# Altium schematic sheet Pulser.SchDoc: Pulser Laser Board
size A4; Date: 04.08.2023; DocumentNumber: 2; SheetNumber: 2; SheetTotal: 2; FileInfo: Pulser.SchDoc
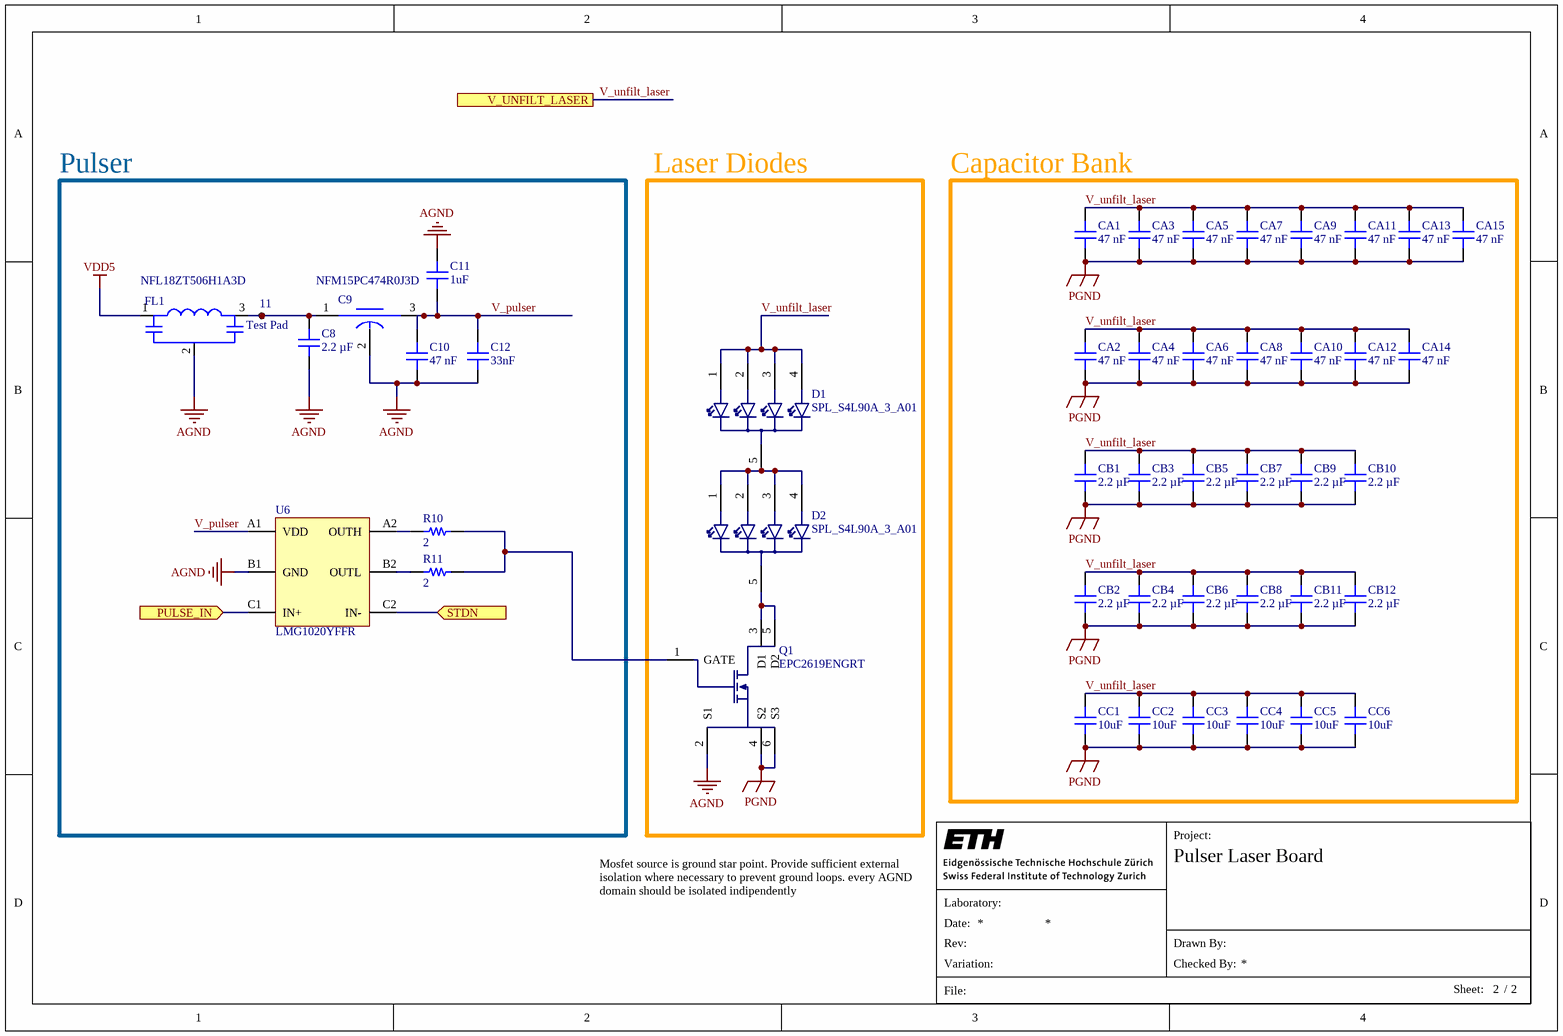
[diagram p0: Pulser.SchDoc]

## Parts
11  Test Pad  [Pad-0.6mm]  (no BOM)
C8  2.2 µF  [CAP 0603_1608]
C9  NFM15PC474R0J3D  [FP-NFM15-0_05-MFG]
C10  47 nF  [CAPC0510X35N]
C11  1uF  [FP-LLL152-0_2-MFG]
C12  33nF  [FP-LLL03T-0_03-IPC_C]
CA1  47 nF  [CAPC0510X35N]
CA2  47 nF  [CAPC0510X35N]
CA3  47 nF  [CAPC0510X35N]
CA4  47 nF  [CAPC0510X35N]
CA5  47 nF  [CAPC0510X35N]
CA6  47 nF  [CAPC0510X35N]
CA7  47 nF  [CAPC0510X35N]
CA8  47 nF  [CAPC0510X35N]
CA9  47 nF  [CAPC0510X35N]
CA10  47 nF  [CAPC0510X35N]
CA11  47 nF  [CAPC0510X35N]
CA12  47 nF  [CAPC0510X35N]
CA13  47 nF  [CAPC0510X35N]
CA14  47 nF  [CAPC0510X35N]
CA15  47 nF  [CAPC0510X35N]
CB1  2.2 µF  [CAP 0603_1608]
CB2  2.2 µF  [CAP 0603_1608]
CB3  2.2 µF  [CAP 0603_1608]
CB4  2.2 µF  [CAP 0603_1608]
CB5  2.2 µF  [CAP 0603_1608]
CB6  2.2 µF  [CAP 0603_1608]
CB7  2.2 µF  [CAP 0603_1608]
CB8  2.2 µF  [CAP 0603_1608]
CB9  2.2 µF  [CAP 0603_1608]
CB10  2.2 µF  [CAP 0603_1608]
CB11  2.2 µF  [CAP 0603_1608]
CB12  2.2 µF  [CAP 0603_1608]
CC1  10uF  [CAP 0603_1608]
CC2  10uF  [CAP 0603_1608]
CC3  10uF  [CAP 0603_1608]
CC4  10uF  [CAP 0603_1608]
CC5  10uF  [CAP 0603_1608]
CC6  10uF  [CAP 0603_1608]
D1  SPL_S4L90A_3_A01  [SPLS4L90A_3A01]
D2  SPL_S4L90A_3_A01  [SPLS4L90A_3A01]
FL1  NFL18ZT506H1A3D  [NFL18ST107H1A3D]
Q1  EPC2619ENGRT  [EPC2619ENGRT]
R10  2  [RES 0201_0603]
R11  2  [RES 0201_0603]
U6  LMG1020YFFR  [BGA6C40P2X3_86X126X62]

## Blocks framed on the sheet
Pulser: 11 C8-C12 FL1 R10 R11 U6
Laser Diodes: D1 D2 Q1
Capacitor Bank: CA1-CA15 CB1-CB12 CC1-CC6

## Ports
PULSE_IN (in), STDN (in), V_UNFILT_LASER

## Nets
AGND: C8.1 C9.2(GND) C10.1 C11.2 C12.1 FL1.2 Q1.2(S1) U6.B1(GND)
PGND: CA1.1 CA2.1 CA3.1 CA4.1 CA5.1 CA6.2 CA7.1 CA8.1 CA9.1 CA10.1 CA11.1 CA12.2 CA13.2 CA14.1 CA15.1 CB1.1 CB2.1 CB3.1 CB4.1 CB5.1 CB6.1 CB7.1 CB8.1 CB9.1 CB10.1 CB11.1 CB12.1 CC1.1 CC2.1 CC3.1 CC4.1 CC5.1 CC6.1 Q1.4(S2) Q1.6(S3)
VDD5: FL1.1
PULSE_IN: U6.C1(IN+) ; port PULSE_IN
STDN: U6.C2(IN-) ; port STDN
V_pulser: C9.3(Output) C10.2 C11.1 C12.2 U6.A1(VDD)
V_unfilt_laser: CA1.2 CA2.2 CA3.2 CA4.2 CA5.2 CA6.1 CA7.2 CA8.2 CA9.2 CA10.2 CA11.2 CA12.1 CA13.1 CA14.2 CA15.2 CB1.2 CB2.2 CB3.2 CB4.2 CB5.2 CB6.2 CB7.2 CB8.2 CB9.2 CB10.2 CB11.2 CB12.2 CC1.2 CC2.2 CC3.2 CC4.2 CC5.2 CC6.2 D1.1(ANODE_CH1) D1.2(ANODE_CH2) D1.3(ANODE_CH3) D1.4(ANODE_CH4) ; port V_UNFILT_LASER
Net11_1: 11.1 C8.2 C9.1(Input) FL1.3
NetD1_5: D1.5(COM_CATHODE) D2.1(ANODE_CH1) D2.2(ANODE_CH2) D2.3(ANODE_CH3) D2.4(ANODE_CH4)
NetD2_5: D2.5(COM_CATHODE) Q1.3(D1) Q1.5(D2)
NetQ1_1: Q1.1(GATE) R10.2 R11.2
NetR10_1: R10.1 U6.A2(OUTH)
NetR11_1: R11.1 U6.B2(OUTL)

## Notes on the sheet
- Mosfet source is ground star point. Provide sufficient external isolation where necessary to prevent ground loops. every AGND domain should be isolated indipendently
- Project:
- Laboratory:
- Date:
- File:
- Rev:
- Variation:
- Drawn By:
- Checked By:
- Sheet:
- /

## Library data of the parts
11 = Test Pad: 0.6mm SMT Test Pad; Mounting Technology: SMT
C8 CB1-CB12 = GRM188R61H225KE11D: CAP CER 2.2UF 50V X5R 0603; manufacturer: Murata Electronics; Tolerance: ±10%; Part Number: GRM188R61H225KE11D; Applications: General Purpose; Capacitance: 2.2 µF; componentlink1description: Datasheet; componentlink1url: https://search.murata.co.jp/Ceramy/image/img/A01X/G101/ENG/GRM188R61H225KE11-01.pdf; componentlink2description: DigiKey Link; componentlink2url: https://www.digikey.com/en/products/detail/murata-electronics/GRM188R61H225KE11D/4905363; Device Package: 0603 (1608 Metric); lastupdated: 15/07/2023 19:07:37; Lifecycle Status: Active; Minimum Order: 1; Mounting Type: Surface Mount, MLCC; Operating Temperature: -55°C ~ 85°C; Package / Case: 0603 (1608 Metric); packaging: TapeAndReel; partid: 39151; Part Status: Active; price: 0.04; series: GRM; Size / Dimension: 0.063" L x 0.031" W (1.60mm x 0.80mm); Supplier 1: DigiKey; Supplier Part Number 1: 490-10733-1-ND; Temperature Coefficient: X5R; Thickness (Max): 0.039" (1.00mm); Voltage - Rated: 50V; Value: 2.2 µF; Supplier 2: Mouser; Supplier Part Number 2: 81-GRM188R61H225KE1D
C9 = NFM15PC474R0J3D: CAP Feed Through, 470 nF, 6.3V, 2A, 3 Pin(s); Manufacturer: Murata; Tolerance: 20%; DC Resistance (DCR): 30mR; Capacitance: 470nF; Voltage Rating: 4V; Channels: 1; Filter Type: FEED THROUGH CAPACITOR; Value: 470mF; Length: 0.039inch; Max Operating Temperature: 105°C; Case/Package: 0402; Width: 0.02inch; Packaging: Tape and Reel; Current: 2A; Mount: Surface Mount; Height: 0.02inch; Min Operating Temperature: -55°C; Package Quantity: 10000; Manufacturer Part Number: NFM15PC474R0J3D; Category: Ceramic Capacitors; ComponentLink1Description: https://datasheet.ciiva.com:443/pdfs/VipMasterIC/IC/MURE/MURE-S-A0002978318/MURE-S-A0002990019-1.pdf?src-supplier=IHS+Markit; ComponentLink1URL: https://datasheet.ciiva.com:443/pdfs/VipMasterIC/IC/MURE/MURE-S-A0002978318/MURE-S-A0002990019-1.pdf?src-supplier=IHS+Markit; ComponentLink2Description: http://www.mouser.com/ds/2/281/c31e-794748.pdf?src-supplier=Mouser; ComponentLink2URL: http://www.mouser.com/ds/2/281/c31e-794748.pdf?src-supplier=Mouser; ComponentLink3Description: https://search.murata.co.jp/Ceramy/image/img/A01X/G101/ENG/NFM15PC474R0J3-01.pdf?src-supplier=Digi-Key; ComponentLink3URL: https://search.murata.co.jp/Ceramy/image/img/A01X/G101/ENG/NFM15PC474R0J3-01.pdf?src-supplier=Digi-Key; ComponentLink4Description: http://search.murata.co.jp/Ceramy/image/img/A01X/G101/ENG/NFM15PC474R0J3-01.pdf?src-supplier=Digi-Key; ComponentLink4URL: http://search.murata.co.jp/Ceramy/image/img/A01X/G101/ENG/NFM15PC474R0J3-01.pdf?src-supplier=Digi-Key; ComponentLink5Description: http://search.murata.co.jp/Ceramy/image/img/w_hinm/S0109E.pdf?src-supplier=Digi-Key; ComponentLink5URL: http://search.murata.co.jp/Ceramy/image/img/w_hinm/S0109E.pdf?src-supplier=Digi-Key; ComponentLink6Description: https://datasheet.octopart.com/NFM15PC474R0J3D-Murata-datasheet-82526264.pdf?src-supplier=Future+Electronics; ComponentLink6URL: https://datasheet.octopart.com/NFM15PC474R0J3D-Murata-datasheet-82526264.pdf?src-supplier=Future+Electronics; Current Rating: 2A; DC Resistance-Max: 30mR; Mounting Technology: Surface Mount; Pricing: 1=0.1, 10=0.048, 50=0.048, 100=0.043, 1000=0.027, 10000=0.024 (USD); Reach SVHC Compliant: Yes; RoHS: Yes; RoHS Compliant: Yes; Stock: 109781; Supplier 1: Mouser; Supplier: Mouser; Supplier Part Number 1: 81-NFM15PC474R0J3D; Supplier Part Number: 81-NFM15PC474R0J3D
C10 CA1-CA15 = CGAEA1X7R1H473M030BC: CAP CER 47 nF, 50V, 20%  X7R  0204; Manufacturer_Name: TDK; Datasheet Link: https://product.tdk.com/system/files/dam/doc/product/capacitor/ceramic/mlcc/catalog/mlcc_automotive_lwreverse_cga_en.pdf; Height: 0.35mm; Manufacturer_Part_Number: CGAEA1X7R1H473M030BC; Mouser Part Number: 810-CGAEA1X7R1H473M0; Mouser Price/Stock: https://www.mouser.co.uk/ProductDetail/TDK/CGAEA1X7R1H473M030BC?qs=w%2Fv1CP2dgqqHjWKa5Bydbw%3D%3D; Arrow Part Number: CGAEA1X7R1H473M030BC; Arrow Price/Stock: https://www.arrow.com/en/products/cgaea1x7r1h473m030bc/tdk; Category: Ceramic Capacitors; ComponentLink1Description: https://datasheet.ciiva.com:443/pdfs/VipMasterIC/IC/TDKC/TDKC-S-A0005729183/TDKC-S-A0005729183-1.pdf?src-supplier=IHS+Markit; ComponentLink1URL: https://datasheet.ciiva.com:443/pdfs/VipMasterIC/IC/TDKC/TDKC-S-A0005729183/TDKC-S-A0005729183-1.pdf?src-supplier=IHS+Markit; ComponentLink2Description: https://product.tdk.com/info/en/catalog/datasheets/mlcc_automotive_lwreverse_cga_en.pdf?src-supplier=Digi-Key; ComponentLink2URL: https://product.tdk.com/info/en/catalog/datasheets/mlcc_automotive_lwreverse_cga_en.pdf?src-supplier=Digi-Key; Manufacturer: TDK; Manufacturer Part Number: CGAEA1X7R1H473M030BC; Pricing: 1=0.28, 10=0.142, 50=0.142, 100=0.085, 1000=0.075, 10000=0.059 (USD); RoHS: No; Stock: 43378; Supplier 1: Mouser; Supplier: Mouser; Supplier Part Number 1: 810-CGAEA1X7R1H473M0; Supplier Part Number: 810-CGAEA1X7R1H473M0
C11 = LLL152D70J105ME01D: CAP LOW L CER 1UF 6.3V X7T 0204; Manufacturer: Murata; Manufacturer Part Number: LLL152D70J105ME01D; Category: Ceramic Capacitors; Pricing: 1=0.32, 10=0.173, 50=0.173, 100=0.104, 1000=0.08, 10000=0.06 (USD); RoHS: No; Stock: 241363; Supplier 1: Mouser; Supplier: Mouser; Supplier Part Number 1: 81-LLL152D70J105ME01; Supplier Part Number: 81-LLL152D70J105ME01
C12 = LLL03TR61E333KE01: CAP LOW L CER 33nF 25V X5R 0102; Manufacturer: Murata; Manufacturer Part Number: LLL03TR61E333KE01L; Supplier: Digi-Key; Supplier Part Number: 490-LLL03TR61E333KE01LCT-ND; RoHS: Yes; Stock: 19050; Pricing: 1=0.3, 10=0.208, 50=0.1386, 100=0.1179, 500=0.08322, 1000=0.07281, 2500=0.06934, 5000=0.06414 (USD); Reach SVHC Compliant: Yes; RoHS Compliant: Yes; Supplier 1: Mouser; Supplier Part Number 1: 81-LLL03T61E333KE01L
CC1-CC6 = ZRB18AR61E106ME01L: CAP CER 10UF 25V X5R 0603; Manufacturer: Murata; Dielectric Material: Ceramic; Multilayer: Yes; Tolerance  (fill in as +-): 20%; Supplier 1: Mouser; Manufacturer Part Number: ZRB18AR61E106ME01L; RoHS: Yes; Category: Ceramic Capacitors; Stock 1: 348476; Pricing 1: 1=0.36, 10=0.18, 50=0.18, 100=0.128, 1000=0.122, 10000=0.097 (USD); Mounting Technology: Surface Mount; Pins: 2; Package Shape: Rectangular; Case/Package: 0603; Min Operating Temperature: -55°C; Max Operating Temperature: 85°C; Capacitor Type: Ceramic; Packaging: Tape and Reel; Tolerance (fill in as +-): 20%; Rated DC Voltage (URdc): 25V; Temperature Characteristics Code: X5R; Termination: Wraparound; Reach SVHC Compliant: Yes; RoHS Compliant: Yes; ComponentLink1URL: https://datasheet.ciiva.com:443/pdfs/VipMasterIC/IC/MURE/MURE-S-A0004380799/MURE-S-A0004414239-1.pdf?src-supplier=IHS+Markit; ComponentLink1Description: https://datasheet.ciiva.com:443/pdfs/VipMasterIC/IC/MURE/MURE-S-A0004380799/MURE-S-A0004414239-1.pdf?src-supplier=IHS+Markit; ComponentLink2URL: http://www.farnell.com/datasheets/2243360.pdf?src-supplier=Farnell; ComponentLink2Description: http://www.farnell.com/datasheets/2243360.pdf?src-supplier=Farnell; ComponentLink3URL: http://www.farnell.com/datasheets/2243360.pdf?src-supplier=Newark; ComponentLink3Description: http://www.farnell.com/datasheets/2243360.pdf?src-supplier=Newark; ComponentLink4URL: https://datasheet.octopart.com/ZRB18AR61E106ME01L-Murata-datasheet-67356777.pdf?src-supplier=Element14; ComponentLink4Description: https://datasheet.octopart.com/ZRB18AR61E106ME01L-Murata-datasheet-67356777.pdf?src-supplier=Element14; ComponentLink5URL: https://search.murata.co.jp/Ceramy/image/img/A01X/G101/ENG/ZRB18AR61E106ME01-01.pdf?src-supplier=Digi-Key; ComponentLink5Description: https://search.murata.co.jp/Ceramy/image/img/A01X/G101/ENG/ZRB18AR61E106ME01-01.pdf?src-supplier=Digi-Key; ComponentLink6URL: http://www.farnell.com/datasheets/1885591.pdf?src-supplier=Newark; ComponentLink6Description: http://www.farnell.com/datasheets/1885591.pdf?src-supplier=Newark; ComponentLink7URL: http://www.farnell.com/datasheets/2243360.pdf?src-supplier=Element14; ComponentLink7Description: http://www.farnell.com/datasheets/2243360.pdf?src-supplier=Element14; ComponentLink8URL: https://datasheet.octopart.com/ZRB18AR61E106ME01L-Murata-datasheet-166166243.pdf?src-supplier=TME; ComponentLink8Description: https://datasheet.octopart.com/ZRB18AR61E106ME01L-Murata-datasheet-166166243.pdf?src-supplier=TME; Supplier Part Number 1: 81-ZRB18AR61E106ME1L; Value: 10uF
D1 D2 = SPL_S4L90A_3_A01: Diode Laser; Manufacturer_Name: OSRAM; Manufacturer_Part_Number: SPL S4L90A_3 A01; Datasheet Link: https://dammedia.osram.info/media/resource/hires/osram-dam-6648421/SPL%20S4L90A_3%20A01_EN.pdf; Height: 0.69mm; Mouser Part Number: 720-SPLS4L90A3A01; Mouser Price/Stock: https://www.mouser.co.uk/ProductDetail/OSRAM-Opto-Semiconductors/SPL-S4L90A_3-A01?qs=OlC7AqGiEDn4aov%2F5GIeZw%3D%3D; Supplier 1: Mouser; Supplier Part Number 1: 720-SPLS4L90A3A01
FL1 = NFL18ZT506H1A3D: LC Filter; Manufacturer_Name: Murata Electronics; Datasheet Link: https://www.murata.com/en-us/products/productdetail?partno=NFL18ZT506H1A3%23; Height: 0.7mm; Manufacturer_Part_Number: NFL18ZT506H1A3D; Mouser Part Number: 81-NFL18ZT506H1A3D; Mouser Price/Stock: https://www.mouser.co.uk/ProductDetail/Murata-Electronics/NFL18ZT506H1A3D?qs=Ey7%2FXF42M3fNYpmPMs%252BiMA%3D%3D; Supplier 1: Mouser; Supplier Part Number 1: 81-NFL18ZT506H1A3D
Q1 = EPC2619ENGRT: Transistor eGaN; Manufacturer_Name: EPC; Datasheet Link: https://epc-co.com/epc/Portals/0/epc/documents/datasheets/EPC2619_datasheet.pdf?ver=TMorboM_55DlaHDCA464lg%3d%3d; Height: 0.638mm; Manufacturer_Part_Number: EPC2619ENGRT; Supplier 1: Digi-Key; Supplier Part Number 1: 917-EPC2619ENGRTCT-ND
R10 R11 = ERJ-1GNJ2R0C: RES SMD 2 OHM 1% 1/20W 0201; Manufacturer: Panasonic; Tolerance: 5%; Power: 50mW; Rated Temperature: 70°C; Temperature Coefficient: 600ppm/°C; Working Voltage: 25V; Package Height: 0.23mm; Package Length: 0.6mm; Package Width: 0.3mm; Reference Standard: AEC-Q200; Supplier: Mouser; Supplier Part Number: 667-ERJ-1GNJ2R0C; Manufacturer Part Number: ERJ-1GNJ2R0C; RoHS: Yes; Category: Chip SMD Resistors; Stock: 8808; Pricing: 1=0.1, 10=0.018, 50=0.018, 100=0.008, 1000=0.006, 10000=0.004 (USD); Mounting Technology: Surface Mount; Pins: 2; Package Shape: Rectangular; Case/Package: 0201; Terminal Finish: Nickel; Min Operating Temperature: -55°C; Max Operating Temperature: 125°C; JESD-609 Code: e3; Resistor Type: FIXED RESISTOR; Construction: Rectangular; Package Style: SMTMeter; Packaging: Tape and Reel; Technology: METAL GLAZE/THICK FILM; Termination: Wraparound; Reach SVHC Compliant: Yes; RoHS Compliant: Yes; ComponentLink1URL: https://datasheet.ciiva.com:443/pdfs/VipMasterIC/IC/PANA/PANA-S-A0009891627/PANA-S-A0009891627-1.pdf?src-supplier=IHS+Markit; ComponentLink1Description: https://datasheet.ciiva.com:443/pdfs/VipMasterIC/IC/PANA/PANA-S-A0009891627/PANA-S-A0009891627-1.pdf?src-supplier=IHS+Markit; ComponentLink2URL: https://datasheet.ciiva.com/24184/aoa0000ce1-37422-24184055.pdf?src-supplier=Mouser; ComponentLink2Description: https://datasheet.ciiva.com/24184/aoa0000ce1-37422-24184055.pdf?src-supplier=Mouser; Value: 2; Supplier 1: Mouser; Supplier Part Number 1: 667-ERJ-1GNJ2R0C
U6 = LMG1020YFFR: IC Pulser; Manufacturer_Name: Texas Instruments; Datasheet Link: http://www.ti.com/lit/gpn/lmg1020; Height: 0.625mm; Manufacturer_Part_Number: LMG1020YFFR; Mouser Part Number: 595-LMG1020YFFR; Mouser Price/Stock: https://www.mouser.co.uk/ProductDetail/Texas-Instruments/LMG1020YFFR?qs=r5DSvlrkXmJq0cROAgTXeg%3D%3D; Arrow Part Number: LMG1020YFFR; Arrow Price/Stock: https://www.arrow.com/en/products/lmg1020yffr/texas-instruments?region=nac; Supplier 1: Mouser; Supplier Part Number 1: 595-LMG1020YFFR